# Altium schematic sheet Mounting Holes.SchDoc
size 420 x 297 mm; Revision: 1.1.0; SheetNumber: 15; SheetTotal: 15
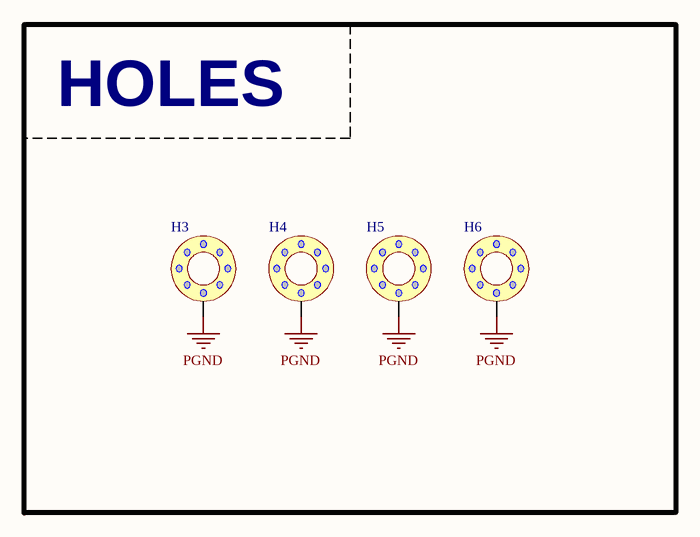
[diagram p0: Mounting Holes.SchDoc]

## Parts
H3  Shield  [HEX-M3]  (value not drawn)
H4  Shield  [HEX-M3]  (value not drawn)
H5  Shield  [HEX-M3]  (value not drawn)
H6  Shield  [HEX-M3]  (value not drawn)

## Blocks framed on the sheet
HOLES: H3-H6

## Nets
PGND: H3.1 H4.1 H5.1 H6.1

## Notes on the sheet
- Project:
- DAL_PDU
- Sub-system:
- IGRVT-50
- Design by:
- KIEN HOANG
- BAO BUI
- Sheet title:
- Sheet
- A3
- of
- Checked by:
- Approved by:
- VU PHAM
- Revision:
- Document No:
- Size:
- Date: